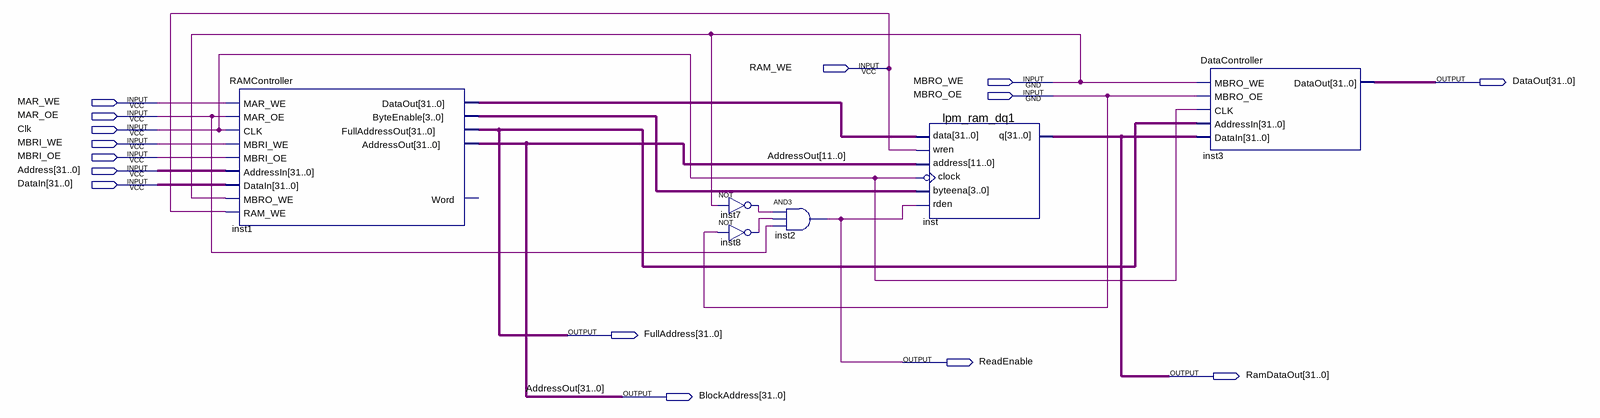
[diagram p0: schematic sheet]
// Quartus schematic RAM.bdf as structural Verilog: 6 symbols, 15 pins
module RAM (
  input  RAM_WE,
  input  MBRO_WE,
  input  MBRO_OE,
  input  MAR_WE,
  input  MAR_OE,
  input  Clk,
  input  MBRI_WE,
  input  MBRI_OE,
  input  [31:0] Address,
  input  [31:0] DataIn,
  output [31:0] DataOut,
  output [31:0] FullAddress,
  output ReadEnable,
  output [31:0] RamDataOut,
  output [31:0] BlockAddress
);

  wire inst7_out, inst8_out;
  wire [3:0] inst1_byteenable;
  wire [31:0] inst1_dataout;

  RAMController inst1 (
    .MAR_WE(MAR_WE), .MAR_OE(MAR_OE), .CLK(Clk), .MBRI_WE(MBRI_WE), .MBRI_OE(MBRI_OE), .AddressIn(Address),
    .DataIn(DataIn), .MBRO_WE(MBRO_WE), .RAM_WE(RAM_WE), .DataOut(inst1_dataout),
    .ByteEnable(inst1_byteenable), .FullAddressOut(FullAddress), .AddressOut(BlockAddress));  // open: Word
  not inst7 (inst7_out, MBRO_WE);
  not inst8 (inst8_out, MBRO_OE);
  and inst2 (ReadEnable, inst7_out, inst8_out, MAR_OE);
  lpm_ram_dq1 inst (
    .data(inst1_dataout), .wren(RAM_WE), .address(BlockAddress[11:0]), .clock(~Clk),
    .byteena(inst1_byteenable), .rden(ReadEnable), .q(RamDataOut));
  DataController inst3 (
    .MBRO_WE(MBRO_WE), .MBRO_OE(MBRO_OE), .CLK(Clk), .AddressIn(FullAddress), .DataIn(RamDataOut),
    .DataOut(DataOut));

  // Other names for the same wires on the sheet: AddressOut[31:0] = BlockAddress
endmodule
